# EAGLE design CAPT-B1-02 Cap Touch Matrix Shield (EAGLE 9.4.2)
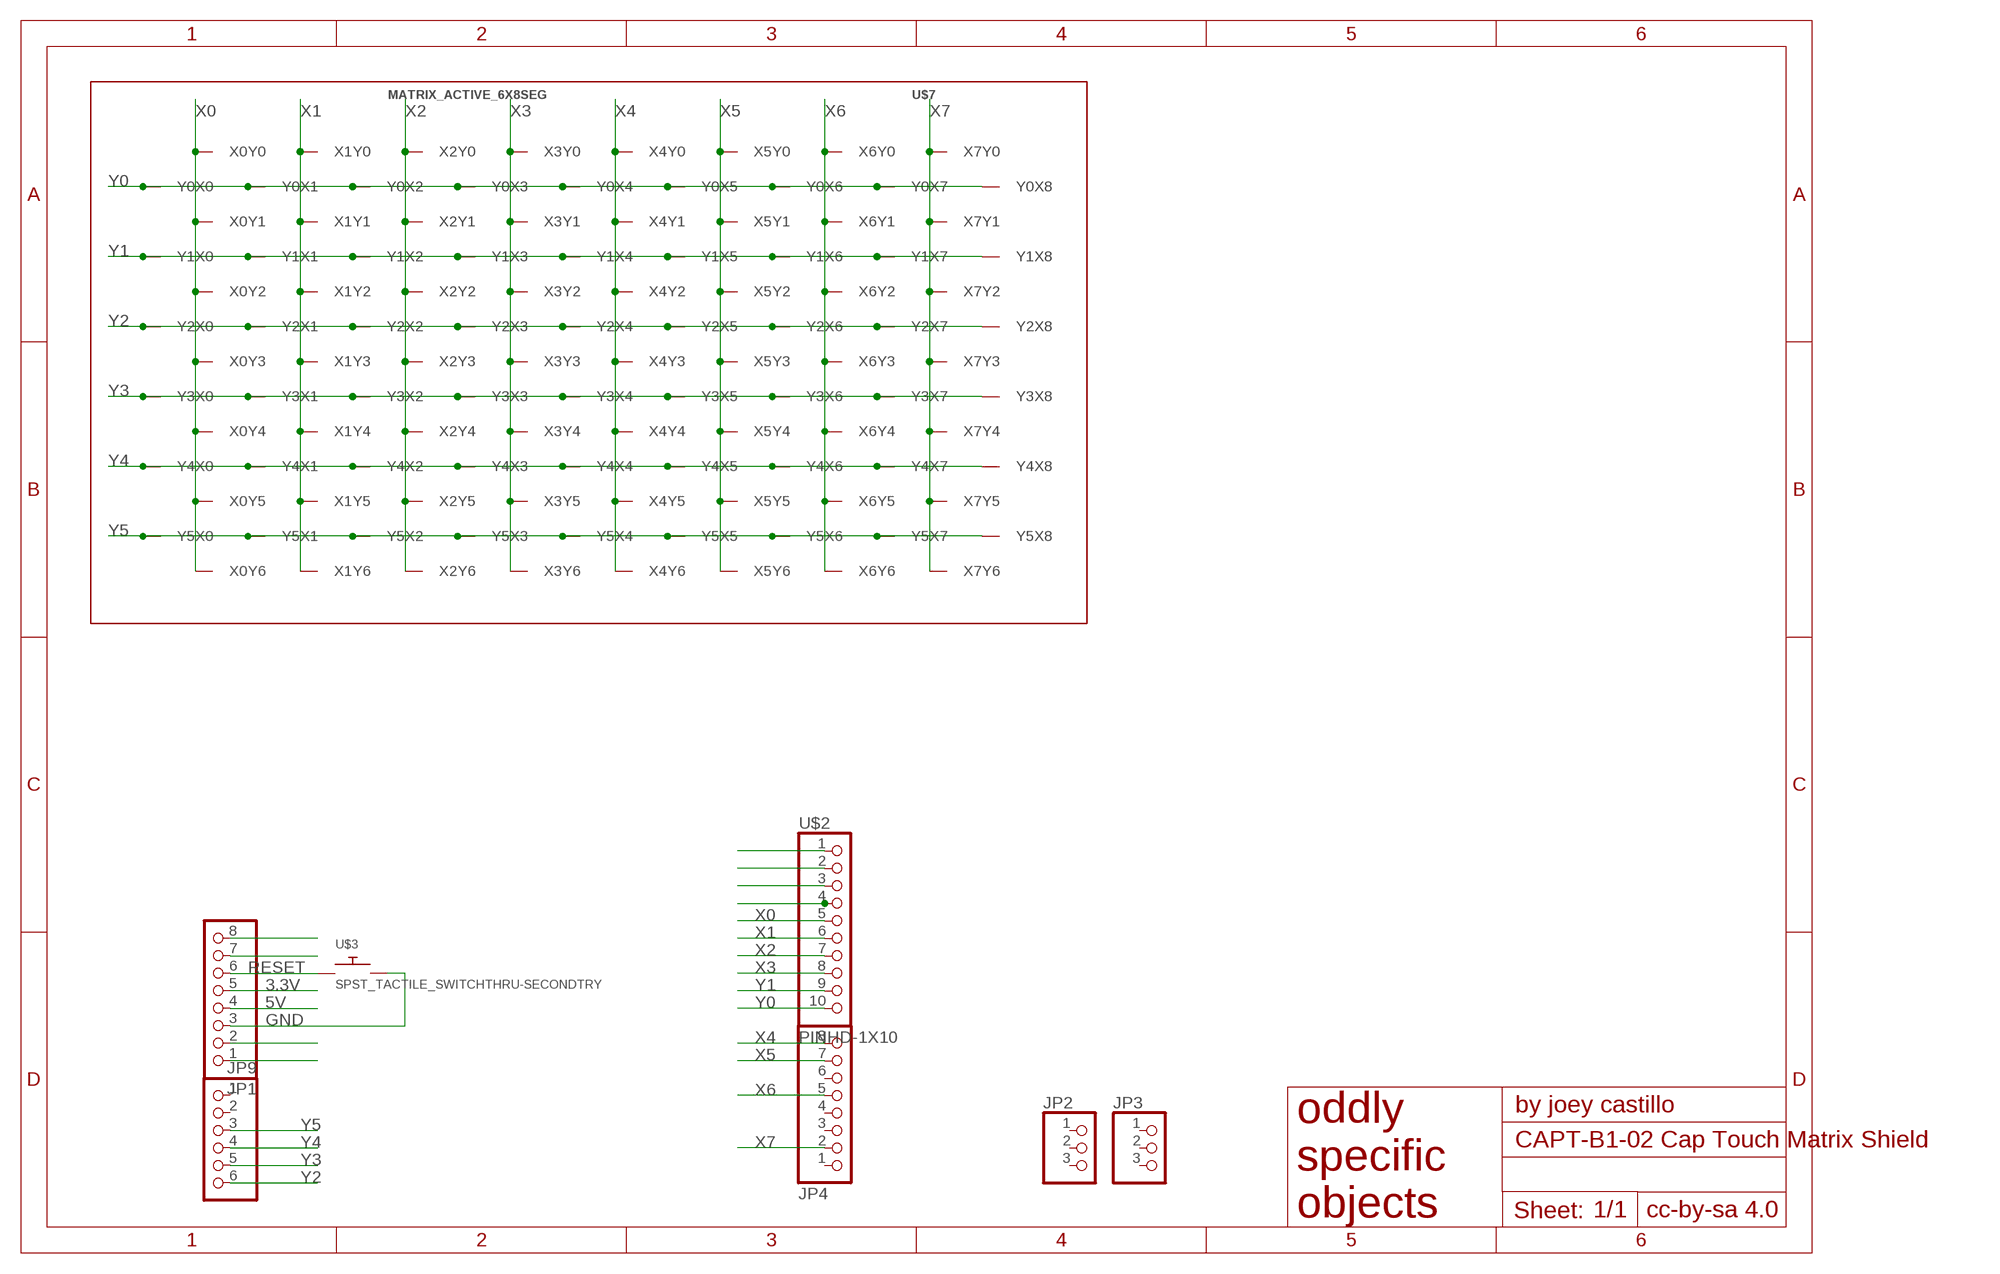
[diagram p0: schematic, sheet 1]

## Parts
JP1  PINHD-1X8CLEANBIG  [1X08-CLEANBIG]
JP2  PINHD-1X3CB  [1X03-CLEANBIG]
JP3  PINHD-1X3CB  [1X03-CLEANBIG]
JP4  PINHD-1X8CLEANBIG  [1X08-CLEANBIG]
JP9  PINHD-1X6CB  [1X06-CLEANBIG]
U$2  PINHD-1X10  [1X10-BIG]
U$3  SPST_TACTILE_SWITCHTHRU-SECONDTRY  [MJTP1250-TRY2]
U$7  MATRIX_ACTIVE_6X8SEG  [MATRIX_ACTIVE_6X8SEG_6MM]

## Nets
3.3V: JP1.5
5V: JP1.4
GND: JP1.3 U$3.P$2
N$1: U$2.4
N$2: U$2.3
N$4: JP1.8
N$6: JP1.2
N$15: JP1.7
N$153: JP1.1
N$154: U$2.1
N$164: U$2.2
RESET: JP1.6 U$3.P$1
X0: U$2.5 U$7.X0Y0 U$7.X0Y1 U$7.X0Y2 U$7.X0Y3 U$7.X0Y4 U$7.X0Y5 U$7.X0Y6
X1: U$2.6 U$7.X1Y0 U$7.X1Y1 U$7.X1Y2 U$7.X1Y3 U$7.X1Y4 U$7.X1Y5 U$7.X1Y6
X2: U$2.7 U$7.X2Y0 U$7.X2Y1 U$7.X2Y2 U$7.X2Y3 U$7.X2Y4 U$7.X2Y5 U$7.X2Y6
X3: U$2.8 U$7.X3Y0 U$7.X3Y1 U$7.X3Y2 U$7.X3Y3 U$7.X3Y4 U$7.X3Y5 U$7.X3Y6
X4: JP4.8 U$7.X4Y0 U$7.X4Y1 U$7.X4Y2 U$7.X4Y3 U$7.X4Y4 U$7.X4Y5 U$7.X4Y6
X5: JP4.7 U$7.X5Y0 U$7.X5Y1 U$7.X5Y2 U$7.X5Y3 U$7.X5Y4 U$7.X5Y5 U$7.X5Y6
X6: JP4.5 U$7.X6Y0 U$7.X6Y1 U$7.X6Y2 U$7.X6Y3 U$7.X6Y4 U$7.X6Y5 U$7.X6Y6
X7: JP4.2 U$7.X7Y0 U$7.X7Y1 U$7.X7Y2 U$7.X7Y3 U$7.X7Y4 U$7.X7Y5 U$7.X7Y6
Y0: U$2.10 U$7.Y0X0 U$7.Y0X1 U$7.Y0X2 U$7.Y0X3 U$7.Y0X4 U$7.Y0X5 U$7.Y0X6 U$7.Y0X7 U$7.Y0X8
Y1: U$2.9 U$7.Y1X0 U$7.Y1X1 U$7.Y1X2 U$7.Y1X3 U$7.Y1X4 U$7.Y1X5 U$7.Y1X6 U$7.Y1X7 U$7.Y1X8
Y2: JP9.6 U$7.Y2X0 U$7.Y2X1 U$7.Y2X2 U$7.Y2X3 U$7.Y2X4 U$7.Y2X5 U$7.Y2X6 U$7.Y2X7 U$7.Y2X8
Y3: JP9.5 U$7.Y3X0 U$7.Y3X1 U$7.Y3X2 U$7.Y3X3 U$7.Y3X4 U$7.Y3X5 U$7.Y3X6 U$7.Y3X7 U$7.Y3X8
Y4: JP9.4 U$7.Y4X0 U$7.Y4X1 U$7.Y4X2 U$7.Y4X3 U$7.Y4X4 U$7.Y4X5 U$7.Y4X6 U$7.Y4X7 U$7.Y4X8
Y5: JP9.3 U$7.Y5X0 U$7.Y5X1 U$7.Y5X2 U$7.Y5X3 U$7.Y5X4 U$7.Y5X5 U$7.Y5X6 U$7.Y5X7 U$7.Y5X8
Unconnected: JP2.1 JP2.2 JP2.3 JP3.1 JP3.2 JP3.3 JP4.1 JP4.3 JP4.4 JP4.6 JP9.1 JP9.2

## Library data of the parts
JP1 JP4 = carduino:PINHD-1X8: PIN HEADER
JP2 JP3 = adafruit:PINHD-1X3: PIN HEADER
JP9 = carduino:PINHD-1X6: PIN HEADER
U$2 = adafruit:PINHD-1X10: Pin header 1x10 0.1" spacing With round pins
U$3 = My Stuff:SPST_TACTILE_SWITCH
U$7 = My Stuff:MATRIX_ACTIVE_6X8SEG

## Board
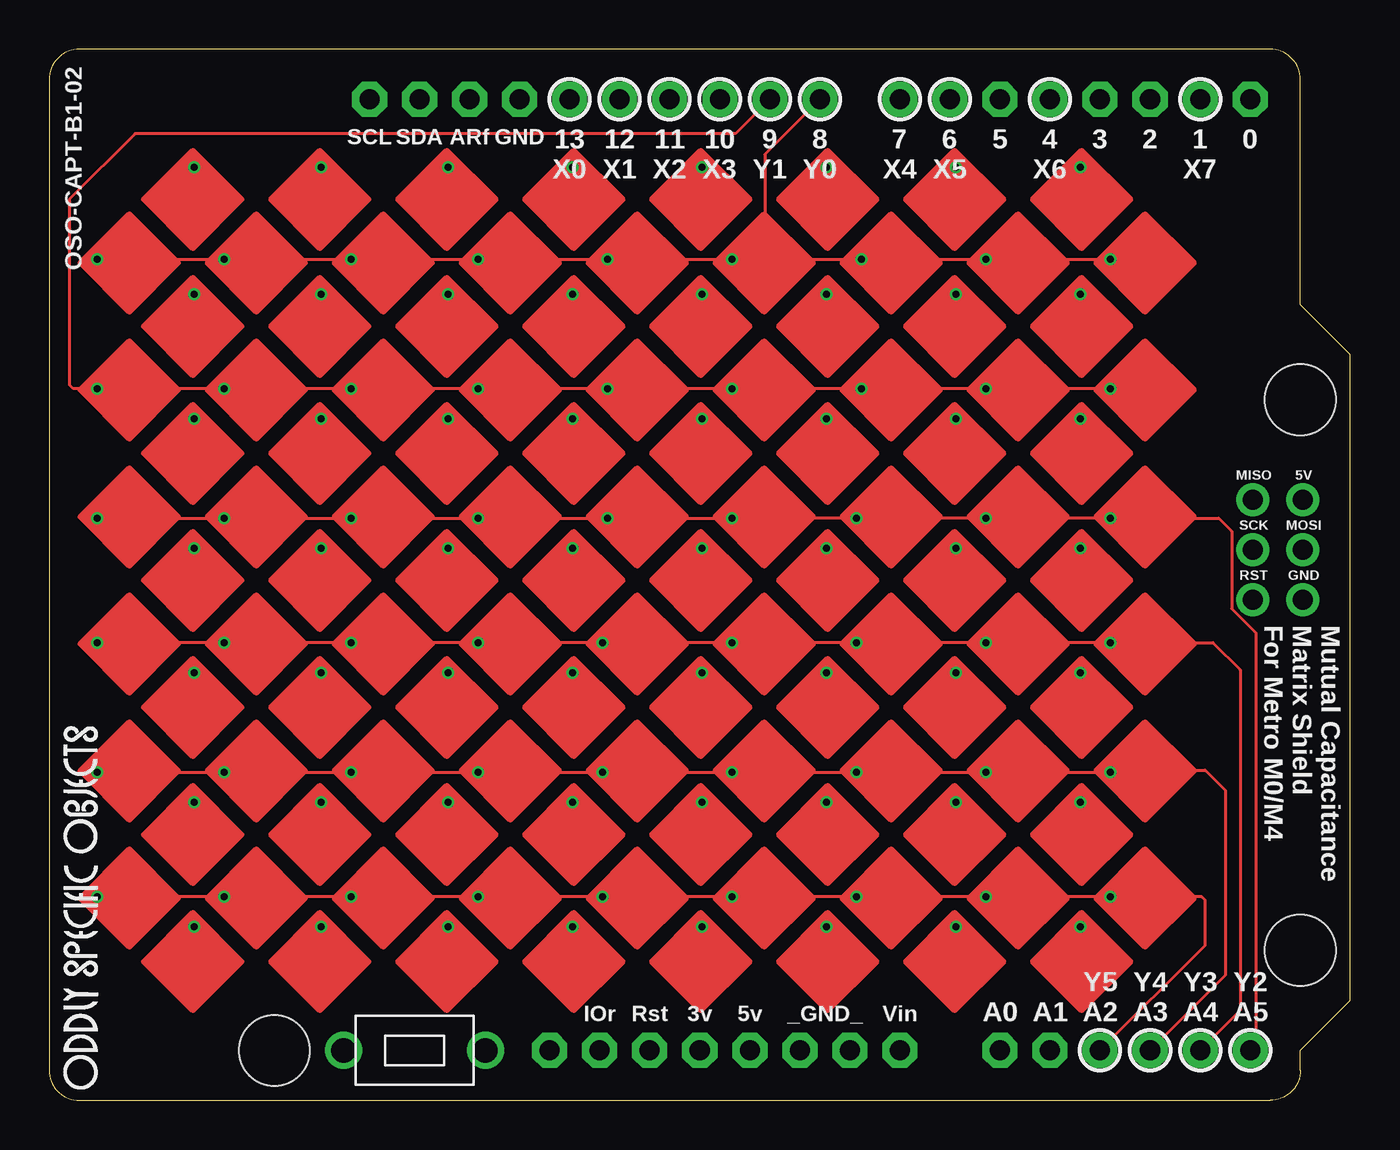
[diagram p1: board, top side]
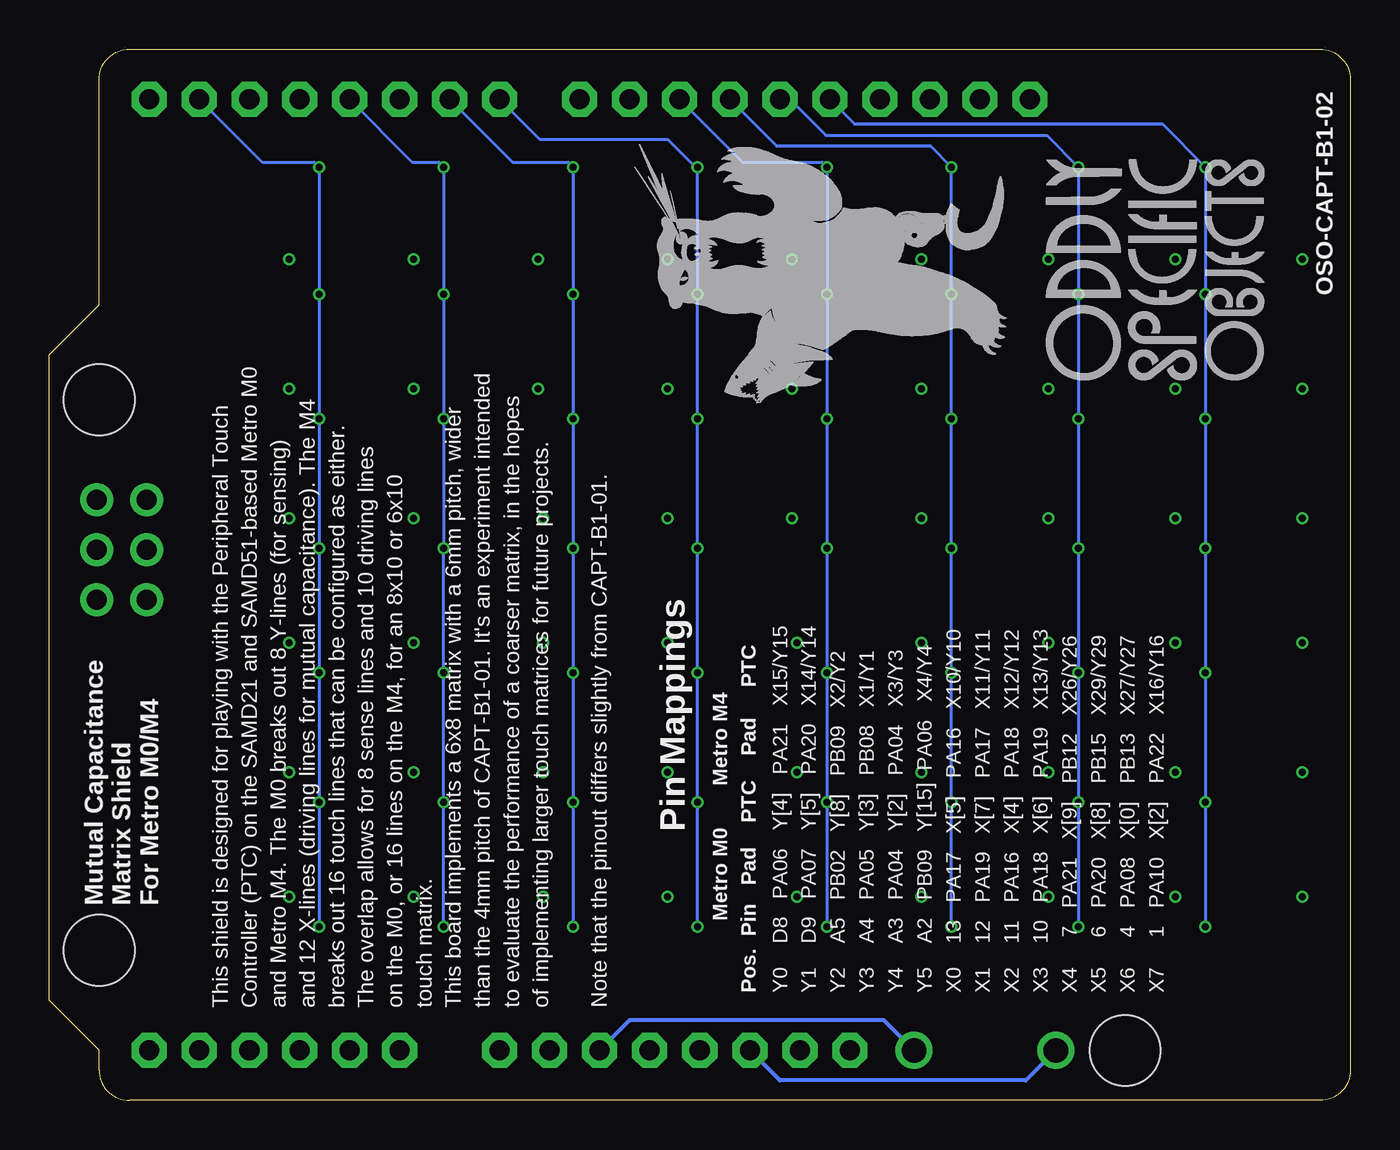
[diagram p2: board, bottom side, seen from below]

Size 66.04 x 53.34 mm. Coordinates in mm from the lower left corner, seen from the top.
Outline: 63.5,1.52 63.5,2.54 66.04,5.08 66.04,37.85 63.5,40.39 63.5,51.82 arc90 61.98,53.34 1.52,53.34 arc90 0,51.82 0,1.52 arc90 1.52,0 61.98,0 arc90 63.5,1.52
Copper layers (1*16): Top 0.035559375mm / dielectric 1.6mm / Bottom 0.035559375mm
Design rules "oshpark-2layer *": minimum track width 6mil, minimum drill 10mil, track to track 6mil, track to pad 6mil, pad to pad 6mil, via to via 6mil, smd to smd 6mil, copper to edge 15mil, drill to drill 6mil, minimum pad ring 5mil, minimum via ring 5mil, stop-mask expansion 2.5mil, vias tented up to drill 10mil, thermal gap 10mil
Holes 3.59 mm at 63.5,35.56 11.43,2.54 63.5,7.62

### Footprints (pad centres in the part's own frame; a part is rotated, then mirrored left to right if it is on the bottom)
1X08-CLEANBIG = drill 1.016 pad 1.778 octagon: 1 -8.89,0; 2 -6.35,0; 3 -3.81,0; 4 -1.27,0; 5 1.27,0; 6 3.81,0; 7 6.35,0; 8 8.89,0
1X03-CLEANBIG = drill 1.016 pad 1.676: 1 -2.54,0; 2 0,0; 3 2.54,0
1X06-CLEANBIG = drill 1.016 pad 1.778 octagon: 1 -6.35,0; 2 -3.81,0; 3 -1.27,0; 4 1.27,0; 5 3.81,0; 6 6.35,0
1X10-BIG = drill 1.016 pad 1.778 octagon: 1 -11.43,0; 2 -8.89,0; 3 -6.35,0; 4 -3.81,0; 5 -1.27,0; 6 1.27,0; 7 3.81,0; 8 6.35,0; 9 8.89,0; 10 11.43,0
MJTP1250-TRY2 = drill 1.25: P$1 -3.6,0; P$2 3.6,0
MATRIX_ACTIVE_6X8SEG_6MM = drill 0.356: X0Y0 -23.384,19.415; X0Y1 -23.384,12.97; X0Y2 -23.384,6.652; X0Y3 -23.384,0.08; X0Y4 -23.384,-6.238; X0Y5 -23.384,-12.81; X0Y6 -23.384,-19.128; X1Y0 -16.939,19.415; X1Y1 -16.939,12.97; X1Y2 -16.939,6.652; X1Y3 -16.939,0.08; X1Y4 -16.939,-6.238; X1Y5 -16.939,-12.81; X1Y6 -16.939,-19.128; X2Y0 -10.494,19.415; X2Y1 -10.494,12.97; X2Y2 -10.494,6.652; X2Y3 -10.494,0.08; X2Y4 -10.494,-6.238; X2Y5 -10.494,-12.81; X2Y6 -10.494,-19.128; X3Y0 -4.176,19.415; X3Y1 -4.176,12.97; X3Y2 -4.176,6.652; X3Y3 -4.176,0.08; X3Y4 -4.176,-6.238; X3Y5 -4.176,-12.81; X3Y6 -4.176,-19.128; X4Y0 2.396,19.415; X4Y1 2.396,12.97; X4Y2 2.396,6.652; X4Y3 2.396,0.08; X4Y4 2.396,-6.238; X4Y5 2.396,-12.81; X4Y6 2.396,-19.128; X5Y0 8.714,19.415; X5Y1 8.714,12.97; X5Y2 8.714,6.652; X5Y3 8.714,0.08; X5Y4 8.714,-6.238; X5Y5 8.714,-12.81; X5Y6 8.714,-19.128; X6Y0 15.286,19.415; X6Y1 15.286,12.97; X6Y2 15.286,6.652; X6Y3 15.286,0.08; X6Y4 15.286,-6.238; X6Y5 15.286,-12.81; X6Y6 15.286,-19.128; X7Y0 21.604,19.415; X7Y1 21.604,12.97; X7Y2 21.604,6.652; X7Y3 21.604,0.08; X7Y4 21.604,-6.238; X7Y5 21.604,-12.81; X7Y6 21.604,-19.128; Y0X0 -28.305,14.748; Y0X1 -21.86,14.748; Y0X2 -15.415,14.748; Y0X3 -8.97,14.748; Y0X4 -2.398,14.748; Y0X5 3.92,14.748; Y0X6 10.492,14.748; Y0X7 16.81,14.748; Y0X8 23.128,14.748; Y1X0 -28.305,8.176; Y1X1 -21.86,8.176; Y1X2 -15.415,8.176; Y1X3 -8.97,8.176; Y1X4 -2.398,8.176; Y1X5 3.92,8.176; Y1X6 10.492,8.176; Y1X7 16.81,8.176; Y1X8 23.128,8.176; Y2X0 -28.305,1.604; Y2X1 -21.86,1.604; Y2X2 -15.415,1.604; Y2X3 -8.97,1.604; Y2X4 -2.398,1.604; Y2X5 3.92,1.604; Y2X6 10.238,1.604; Y2X7 16.81,1.604; Y2X8 23.128,1.604; Y3X0 -28.305,-4.714; Y3X1 -21.86,-4.714; Y3X2 -15.415,-4.714; Y3X3 -8.97,-4.714; Y3X4 -2.652,-4.714; Y3X5 3.92,-4.714; Y3X6 10.238,-4.714; Y3X7 16.81,-4.714; Y3X8 23.128,-4.714; Y4X0 -28.305,-11.286; Y4X1 -21.86,-11.286; Y4X2 -15.415,-11.286; Y4X3 -8.97,-11.286; Y4X4 -2.652,-11.286; Y4X5 3.92,-11.286; Y4X6 10.238,-11.286; Y4X7 16.81,-11.286; Y4X8 23.128,-11.286; Y5X0 -28.305,-17.604; Y5X1 -21.86,-17.604; Y5X2 -15.415,-17.604; Y5X3 -8.97,-17.604; Y5X4 -2.652,-17.604; Y5X5 3.92,-17.604; Y5X6 10.238,-17.604; Y5X7 16.81,-17.604; Y5X8 23.128,-17.604

### Placement (x,y rotation side)
JP1  34.29,2.54 180 top
JP2  61.09,27.94 90 top
JP3  63.63,27.94 90 top
JP4  52.07,50.8 180 top
JP9  54.61,2.54 0 top
U$2  27.69,50.8 0 top
U$3  18.54,2.54 0 top
U$4  [OSO_BEAR_525X750MIL_1000DPI]  26.92,41.91 90 bottom
U$5  [OSO_WORDMARK_ONELINE_725MIL_1000DPI]  2.54,0.51 90 top
U$6  [OSO_WORDMARK_THREELINE_450MIL_1000DPI]  9.91,42.16 90 bottom
U$7  30.73,27.94 0 top

### Tracks (layer width: path | path; a pad name or v marks a point on that pad's centre or on a via)
GND
  Bottom 0.203: U$3.P$2 23.67,4.06 36.58,4.06 JP1.3
RESET
  Bottom 0.203: U$3.P$1 16.47,1.02 28.96,1.02 JP1.6
X0
  Bottom 0.152: U$2.5 25.15,49.53 9.52,49.53 U$7.X0Y0 U$7.X0Y1 U$7.X0Y2 U$7.X0Y3 U$7.X0Y4 U$7.X0Y5 U$7.X0Y6
X1
  Bottom 0.152: U$7.X1Y6 U$7.X1Y5 U$7.X1Y4 U$7.X1Y3 U$7.X1Y2 U$7.X1Y1 U$7.X1Y0 15.41,48.97 26.62,48.97 28.45,50.8 U$2.6
X2
  Bottom 0.152: U$7.X2Y6 U$7.X2Y5 U$7.X2Y4 U$7.X2Y3 U$7.X2Y2 U$7.X2Y1 U$7.X2Y0 21.3,48.41 29.11,48.41 U$2.7
X3
  Bottom 0.152: U$7.X3Y6 U$7.X3Y5 U$7.X3Y4 U$7.X3Y3 U$7.X3Y2 U$7.X3Y1 U$7.X3Y0 26.81,47.61 30.84,47.61 U$2.8
X4
  Bottom 0.152: U$7.X4Y6 U$7.X4Y5 U$7.X4Y4 U$7.X4Y3 U$7.X4Y2 U$7.X4Y1 33.13,47.24 | 33.13,47.24 U$7.X4Y0 | JP4.8 41.15,48.77 34.65,48.77 33.13,47.24
X5
  Bottom 0.152: U$7.X5Y6 U$7.X5Y5 U$7.X5Y4 U$7.X5Y3 U$7.X5Y2 U$7.X5Y1 U$7.X5Y0 39.7,47.61 42.53,47.61 JP4.7
X6
  Bottom 0.152: U$7.X6Y6 U$7.X6Y5 U$7.X6Y4 U$7.X6Y3 U$7.X6Y2 U$7.X6Y1 U$7.X6Y0 46.27,47.61 47.61,47.61 JP4.5
X7
  Bottom 0.152: U$7.X7Y6 U$7.X7Y5 U$7.X7Y4 U$7.X7Y3 U$7.X7Y2 U$7.X7Y1 U$7.X7Y0 52.59,47.61 55.23,47.61 JP4.2
Y0
  Top 0.152: U$2.10 36.32,48.01 36.32,44.36 U$7.Y0X5 | U$7.Y0X0 U$7.Y0X1 U$7.Y0X2 U$7.Y0X3 U$7.Y0X4 U$7.Y0X5 | U$7.Y0X5 U$7.Y0X6 U$7.Y0X7 U$7.Y0X8
Y1
  Top 0.152: U$2.9 34.83,49.05 4.35,49.05 1.02,45.72 1.02,36.32 1.22,36.12 U$7.Y1X0 U$7.Y1X1 U$7.Y1X2 U$7.Y1X3 U$7.Y1X4 U$7.Y1X5 U$7.Y1X6 U$7.Y1X7 U$7.Y1X8
Y2
  Top 0.152: JP9.6 61.24,2.82 61.24,23.74 60.02,24.96 60.02,28.88 59.36,29.54 U$7.Y2X8 U$7.Y2X7 U$7.Y2X6 U$7.Y2X5 U$7.Y2X4 U$7.Y2X3 U$7.Y2X2 U$7.Y2X1 U$7.Y2X0
Y3
  Top 0.152: JP9.5 60.45,4.57 60.45,21.84 59.07,23.23 U$7.Y3X8 U$7.Y3X7 U$7.Y3X6 U$7.Y3X5 U$7.Y3X4 U$7.Y3X3 U$7.Y3X2 U$7.Y3X1 U$7.Y3X0
Y4
  Top 0.152: JP9.4 59.69,6.35 59.69,15.75 58.67,16.76 53.97,16.76 U$7.Y4X8 U$7.Y4X7 U$7.Y4X6 U$7.Y4X5 U$7.Y4X4 U$7.Y4X3 U$7.Y4X2 U$7.Y4X1 U$7.Y4X0
Y5
  Top 0.152: JP9.3 58.67,7.87 58.67,10.16 58.5,10.34 U$7.Y5X8 U$7.Y5X7 U$7.Y5X6 U$7.Y5X5 U$7.Y5X4 U$7.Y5X3 U$7.Y5X2 U$7.Y5X1 U$7.Y5X0

### Text on the board
tPlace: OSO-CAPT-B1-02 | SCL | SDA | ARf | GND | 13 / X0 | 12 / X1 | 11 / X2 | 10 / X3 | 9 / Y1 | 8 / Y0 | 7 / X4 | 6 / X5 | 5 | 4 / X6 | 3 | 2 | 1 / X7 | 0 | MISO | 5V | SCK | MOSI | RST | GND | Mutual Capacitance / Matrix Shield / For Metro M0/M4 | IOr | Rst | 3v | 5v | _GND_ | Vin | A0 | A1 | Y5 / A2 | Y4 / A3 | Y3 / A4 | Y2 / A5
bPlace: OSO-CAPT-B1-02 | Pin Mappings | Mutual Capacitance / Matrix Shield / For Metro M0/M4 | Y0 D8 PA06 Y[4] PA21 X15/Y15 / Y1 D9 PA07 Y[5] PA20 X14/Y14 / Y2 A5 PB02 Y[8] PB09 X2/Y2 / Y3 A4 PA05 Y[3] PB08 X1/Y1 / Y4 A3 PA04 Y[2] PA04 X3/Y3 / Y5 A2 PB09 Y[15] PA06 X4/Y4 / X0 13 PA17 X[5] PA16 X10/Y10 / X1 12 PA19 X[7] PA17 X11/Y11 / X2 11 PA16 X[4] PA18 X12/Y12 / X3 10 PA18 X[6] PA19 X13/Y13 / X4 7 PA21 X[9] PB12 X26/Y26 / X5 6 PA20 X[8] PB15 X29/Y29 / X6 4 PA08 X[0] PB13 X27/Y27 / X7 1 PA10 X[2] PA22 X16/Y16 | Metro M0 Metro M4 / Pos. Pin Pad PTC Pad PTC | This shield is designed for playing with the Peripheral Touch / Controller (PTC) on the SAMD21 and SAMD51-based Metro M0 / and Metro M4. The M0 breaks out 8 Y-lines (for sensing) / and 12 X-lines (driving lines for mutual capacitance). The M4 / breaks out 16 touch lines that can be configured as either. / The overlap allows for 8 sense lines and 10 driving lines / on the M0, or 16 lines on the M4, for an 8x10 or 6x10 / touch matrix. / This board implements a 6x8 matrix with a 6mm pitch, wider / than the 4mm pitch of CAPT-B1-01. It's an experiment intended / to evaluate the performance of a coarser matrix, in the hopes / of implementing larger touch matrices for future projects. / / Note that the pinout differs slightly from CAPT-B1-01.